# Altium schematic sheet usb.SchDoc
size 297 x 209 mm
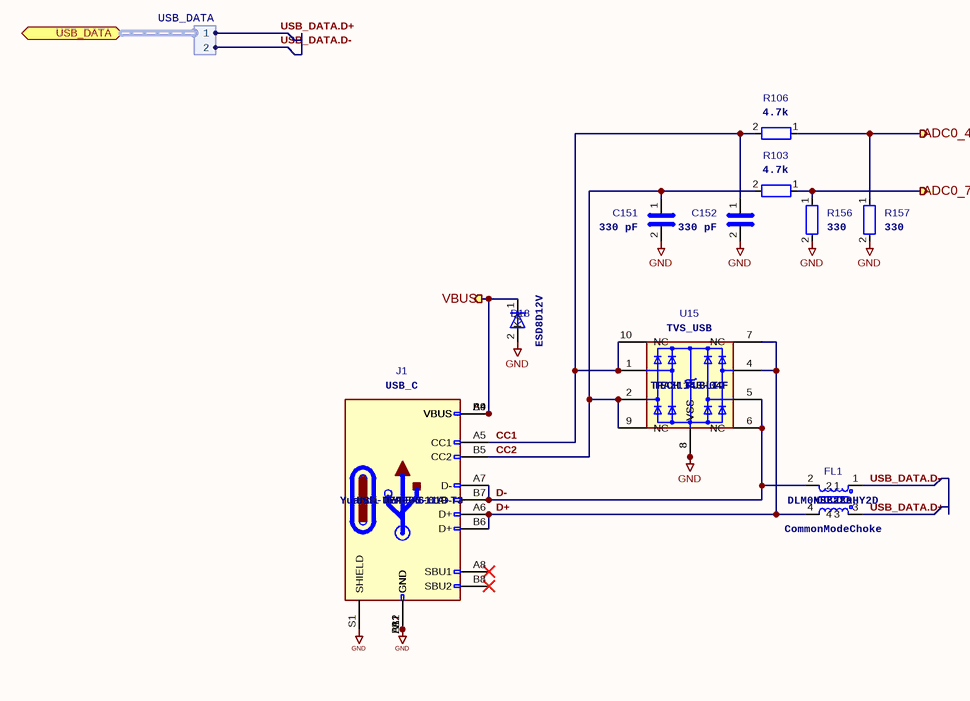
[diagram p0: usb.SchDoc]

## Parts
C151  330 pF  [C_0201_0603Metric]
C152  330 pF  [C_0201_0603Metric]
D18  Part Number: ESD8D12V  [TSLP-2-19]  (hidden comment: TVS)
FL1  Manufacturer: Murata  Part Number: DLM0NSB280HY2D  [L_CommonModeChoke_Murata_DLM0NS]  (hidden comment: CommonModeChoke)
J1  Manufacturer: DEALON  Part Number: USB-TYPE-C-019  Substitution: Yuandi TYPE-611A-T3  [USB_C_Receptacle_HRO_TYPE-C-31-M-12]  (hidden comment: USB_C)
R103  4.7k  [R_0201_0603Metric]
R106  4.7k  [R_0201_0603Metric]
R156  330  [R_0201_0603Metric]
R157  330  [R_0201_0603Metric]
U15  Manufacturer: TECH PUBLIC  Part Number: TPAZ1143-04F  [Diodes_UDFN-10_1.0x2.5mm_P0.5mm]  (hidden comment: TVS_USB)

## Ports
ADC0_4 (out), ADC0_7 (out), USB_DATA (bidir, harness USB_DATA), VBUS (out)

## Harnesses
USB_DATA: 1, 2

## Nets
GND: C151.2 C152.2 D18.2(A) J1.A1(GND) J1.A12(GND) J1.B1(GND) J1.B12(GND) J1.S1(SHIELD) R156.2 R157.2 U15.3(VSS) U15.8(VSS)
ADC0_4: R106.1 R157.1 ; port ADC0_4
ADC0_7: R103.1 R156.1 ; port ADC0_7
CC1: C152.1 J1.A5(CC1) R106.2 U15.1 U15.10(NC)
CC2: C151.1 J1.B5(CC2) R103.2 U15.2 U15.9(NC)
D+: FL1.4 J1.A6(D+) J1.B6(D+) U15.4 U15.7(NC)
D-: FL1.2 J1.A7(D-) J1.B7(D-) U15.5 U15.6(NC)
USB_DATA.D+: FL1.3 ; port USB_DATA.1
USB_DATA.D-: FL1.1 ; port USB_DATA.2
VBUS: D18.1(K) J1.A4(VBUS) J1.A9(VBUS) J1.B4(VBUS) J1.B9(VBUS) ; port VBUS

Not connected (* = marked no-connect by the designer): J1 A8(SBU1)* B8(SBU2)*

## Notes on the sheet
- 1
- 2
- 3
- 4
- 5
- 6
- A
- B
- C
- ${LICENSE}
- D
- Title: ${TITLE}
- File: usb.kicad_sch
- Sheet: /
- ${COPYRIGHT}
- KiCad E.D.A.  kicad (5.1.4)-1
- Size: A4
- Date: ${DATE}
- Rev: ${VERSION}
- Id: 1/1

## Library data of the parts
C151 C152 = C: Part Number: GRM0335C1E331JA01D; Manufacturer: Murata; Substitution: GRM0335C1E331*, GRM0335C1H331*; Value: 330 pF; Footprint: Capacitor_SMD:C_0201_0603Metric
D18 = D_Zener: Manufacturer: MDD; Value: TVS; Footprint: praline:TSLP-2-19
FL1 = Filter_EMI_CommonMode: Value: CommonModeChoke; Footprint: praline:L_CommonModeChoke_Murata_DLM0NS
J1 = USB_C_Receptacle_USB2.0_16P: Value: USB_C; Footprint: praline:USB_C_Receptacle_HRO_TYPE-C-31-M-12
R103 R106 = R: Manufacturer: Yageo; Part Number: RC0201FR-074K7L; Substitution: any equivalent; Value: 4.7k; Footprint: Resistor_SMD:R_0201_0603Metric
R156 R157 = R: Manufacturer: Yageo; Part Number: RC0201JR-07330RL; Substitution: any equivalent; Value: 330; Footprint: Resistor_SMD:R_0201_0603Metric
U15 = D3V3XA4B10LP: Value: TVS_USB; Footprint: Package_DFN_QFN:Diodes_UDFN-10_1.0x2.5mm_P0.5mm